# EAGLE design board (EAGLE 7.4.0)
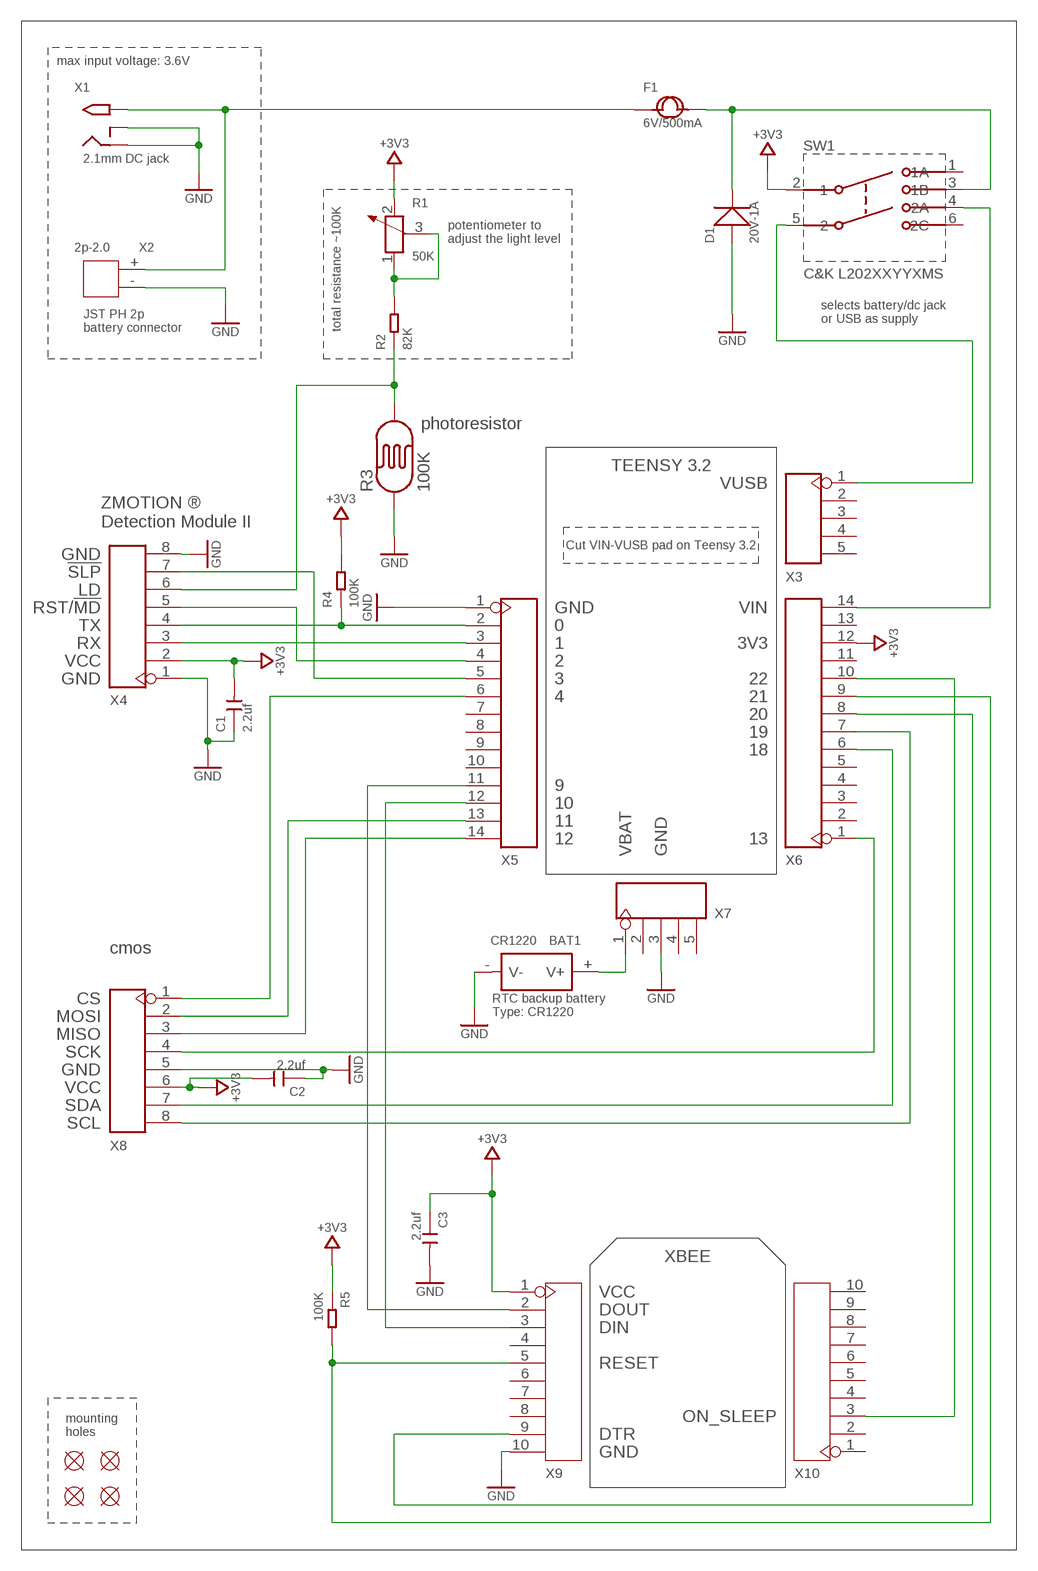
[diagram p0: schematic, sheet 1]

## Parts
BAT1  CR1220  SMD-BATTERY-CELL-HOLDER-PLASTIC  [BAT2P-SMD-16.4-CR1220]
C1  2.2uf  CERAMIC-2.2UF-25V-10%-X7R(0805)  [C0805]
C2  2.2uf  CERAMIC-2.2UF-25V-10%-X7R(0805)  [C0805]
C3  2.2uf  CERAMIC-2.2UF-25V-10%-X7R(0805)  [C0805]
D1  20V-1A  SMD-DIODE-SCHOTTKY-20V-1A(SOD-123)  [SOD-123]
F1  6V/500mA  SMD-PPTC-500MA(1206)  [F1206]
MNT1  MOUNTING_HOLE3.2MM_SILK  [HOLE_3.2MM_SILK]
MNT2  MOUNTING_HOLE3.2MM_SILK  [HOLE_3.2MM_SILK]
MNT3  MOUNTING_HOLE3.2MM_SILK  [HOLE_3.2MM_SILK]
MNT4  MOUNTING_HOLE3.2MM_SILK  [HOLE_3.2MM_SILK]
R1  50K  RES-ADJ-SX3362P  [ADJR3-7.0X7.0X5.0MM]
R2  82K  SMD-RES-56K-5%-1/(0805)  [R0805]
R3  100K  CDS_PHOTOCELL_PHOTORESISTOR4.2X3.4MM_PITCH_2.54MM  [CDS_4.2X3.4MM_PITCH:2.54MM]
R4  100K  SMD-RES-100K-1%-1/8W(0805)  [R0805]
R5  100K  SMD-RES-100K-1%-1/8W(0805)  [R0805]
SW1  C&K L202XXYYXMS  DPDTL202XXYYXMS  [C&K_L102_MS]
X1  2.1MMJACKTHM  [PJ-102A]
X2  2p-2.0  DIP-JST-2P-2.0  [H2-2.0-6X4.5MM]
X3  5p-2.54  DIP-BLACK-FEMALE-HEADER-VERT(5P-2.54)  [H5-2.54]
X4  8p-2.54  DIP-BLACK-FEMALE-HEADER-VERT(8P-2.54)  [H8-2.54]
X5  14p-2.54  DIP-YELLOW-MALE-HEADER-VERT(14P-2.54)  [H14-2.54]
X6  14p-2.54  DIP-YELLOW-MALE-HEADER-VERT(14P-2.54)  [H14-2.54]
X7  5p-2.54  DIP-BLACK-FEMALE-HEADER-VERT(5P-2.54)  [H5-2.54]
X8  8p-2.54  DIP-BLACK-FEMALE-HEADER-VERT(8P-2.54)  [H8-2.54]
X9  10p-2.0  DIP-BLACK-FEMALE-HEADER-VERT(10P-2.0)  [H10-2.0]
X10  10p-2.0  DIP-BLACK-FEMALE-HEADER-VERT(10P-2.0)  [H10-2.0]

## Nets
+3V3: C1.2 C2.2 C3.1 R1.2 R4.2 R5.1 SW1.2 X4.2 X6.12 X8.6 X9.1
D3: X4.7 X5.5
GND: BAT1.-(V-) C1.1 C2.1 C3.2 D1.+ R3.P$1 X1.RING X1.RING_SW X2.- X4.1 X4.8 X5.1 X7.3 X8.5 X9.10
N$1: X5.11 X9.2
N$2: X5.12 X9.3
N$3: BAT1.+(V+) X7.1
N$4: X4.3 X5.3
N$5: R4.1 X4.4 X5.2
N$6: X4.5 X5.4
N$7: R1.1 R1.3 R2.2
N$8: X6.7 X8.8
N$9: X6.6 X8.7
N$10: X6.1 X8.4
N$11: X5.14 X8.3
N$12: X5.13 X8.2
N$13: X5.6 X8.1
N$14: R2.1 R3.P$2 X4.6
N$15: X6.8 X9.9
N$16: R5.2 X6.9 X9.5
N$17: X6.10 X10.3
N$18: SW1.4(2A) X6.14
N$19: SW1.5 X3.1
N$20: D1.- F1.2 SW1.3(1B)
N$23: F1.1 X1.TIP X2.+
Unconnected: SW1.1(1A) SW1.6(2C) X3.2 X3.3 X3.4 X3.5 X5.7 X5.8 X5.9 X5.10 X6.2 X6.3 X6.4 X6.5 X6.11 X6.13 X7.2 X7.4 X7.5 X9.4 X9.6 X9.7 X9.8 X10.1 X10.2 X10.4 X10.5 X10.6 X10.7 X10.8 X10.9 X10.10

## Notes on the sheet
- max input voltage: 3.6V
- 2.1mm DC jack
- potentiometer to 
  adjust the light level
- selects battery/dc jack 
  or USB as supply
- JST PH 2p 
  battery connector
- total resistance ~100K
- photoresistor
- TEENSY 3.2
- VUSB
- ZMOTION ®  
  Detection Module II
- Cut VIN-VUSB pad on Teensy 3.2
- GND
- !SLP
- LD
- RST/!MD | GND | VIN
- TX | 0
- RX | 1 | 3V3
- VCC | 2
- GND | 3 | 22
- 4 | 21
- 20
- 19
- 18
- 9
- 10
- 11
- 12 | 13
- VBAT | GND
- cmos
- CS
- MOSI
- RTC backup battery
  Type: CR1220
- MISO
- SCK
- GND
- VCC
- SDA
- SCL
- XBEE
- VCC
- DOUT
- DIN
- RESET
- ON_SLEEP
- mounting 
  holes
- DTR
- GND

## Library data of the parts
BAT1 = Seeed-OPL-Connector:SMD-BATTERY-CELL-HOLDER-PLASTIC: 320170000
C1-C3 = Seeed-OPL-Capacitor:CERAMIC-2.2UF-25V-10%-X7R(0805): 302010148; MPN: CC0805KKX7R8BB225
D1 = Seeed-OPL-Diode:SMD-DIODE-SCHOTTKY-20V-1A(SOD-123): 304020034; MPN: B5819W
F1 = Seeed-OPL-fuse:SMD-PPTC-500MA(1206): 307010002; MPN: SMD1206R500SF; VALUE: SMD1206R500SF
MNT1-MNT4 = teensybee:MOUNTING_HOLE
R1 = Seeed-OPL-Resistor:RES-ADJ: Potentiometer
R2 = Seeed-OPL-Resistor:SMD-RES-56K-5%-1/(0805): 301010327; MPN: RC0805JR-0756KL; VALUE: 56K
R3 = teensybee:CDS_PHOTOCELL_PHOTORESISTOR
R4 R5 = Seeed-OPL-Resistor:SMD-RES-100K-1%-1/8W(0805): 301010396; MPN: RC0805FR-07100KL
SW1 = teensybee:DPDT
X1 = adafruit:2.1MMJACK: 2.1mm x 5.5mm THM DC jack with internal switch. Digikey part #PJ-102A, 4UCON part #05537 2.1mm x 5.5mm SMT DC jack with internal switch. Digikey part #PJ-002A-SMT, 4UCON part #03267 By microbuilder.eu & adafruit.com
X2 = Seeed-OPL-Connector:DIP-JST-2P-2.0: 320110049
X3 X7 = teensybee:DIP-BLACK-FEMALE-HEADER-VERT(5P-2.54): 320030028; MPN: F185-1105A0BSYA1
X4 X8 = Seeed-OPL-Connector:DIP-BLACK-FEMALE-HEADER-VERT(8P-2.54): 320030061; MPN: F185-1108A1BSYC1
X5 X6 = teensybee:DIP-YELLOW-MALE-HEADER-VERT(14P-2.54): 320020123; MPN: P125-1114A0BS116AX
X9 X10 = Seeed-OPL-Connector:DIP-BLACK-FEMALE-HEADER-VERT(10P-2.0): 320030009; MPN: F243-1110A1BSUA1

## Board
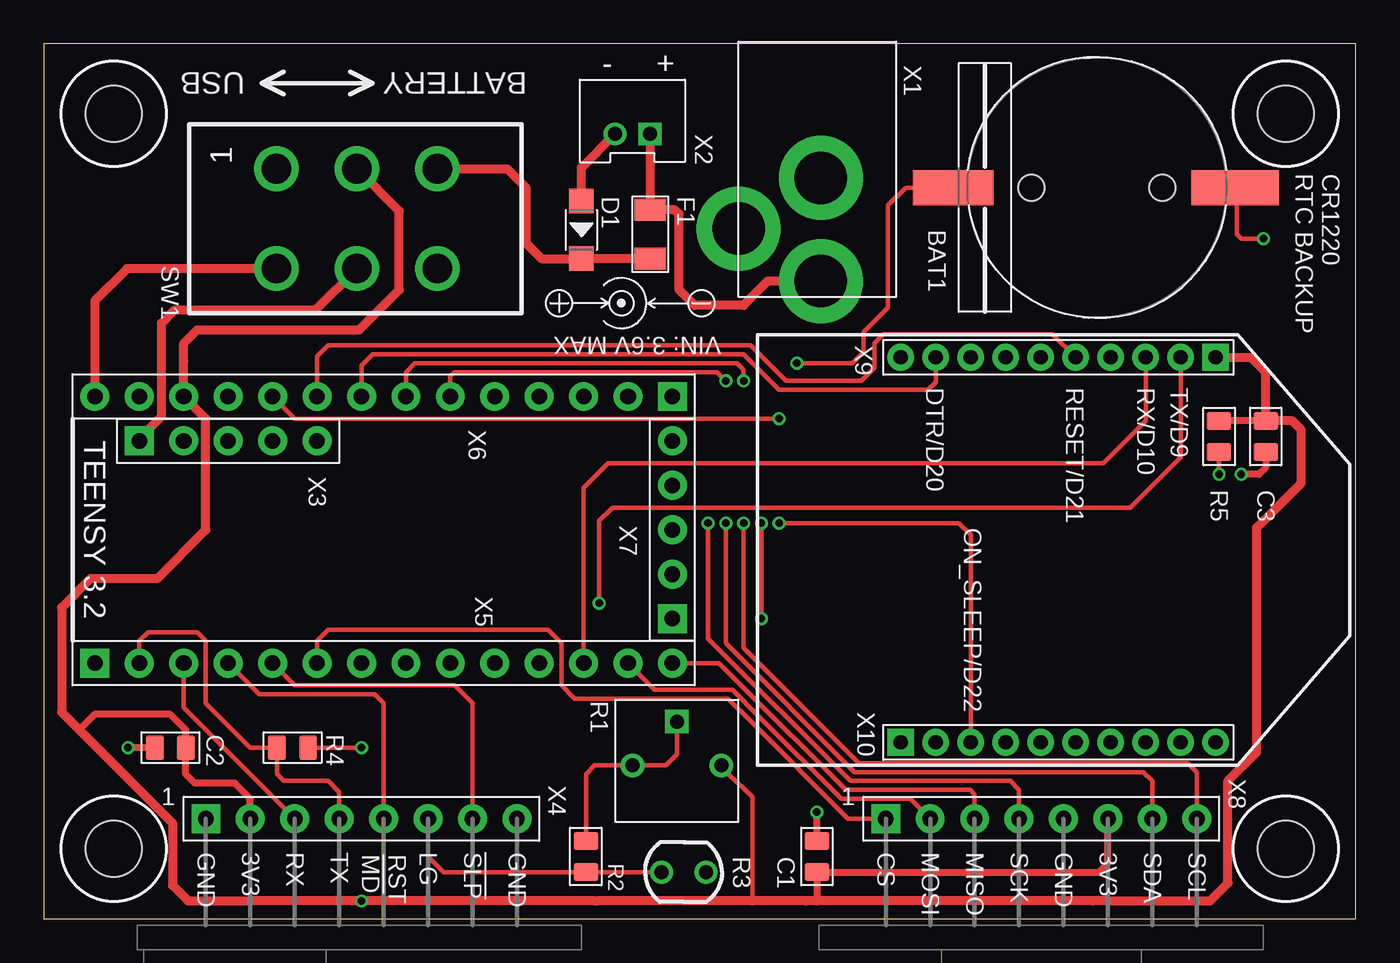
[diagram p1: board, top side]
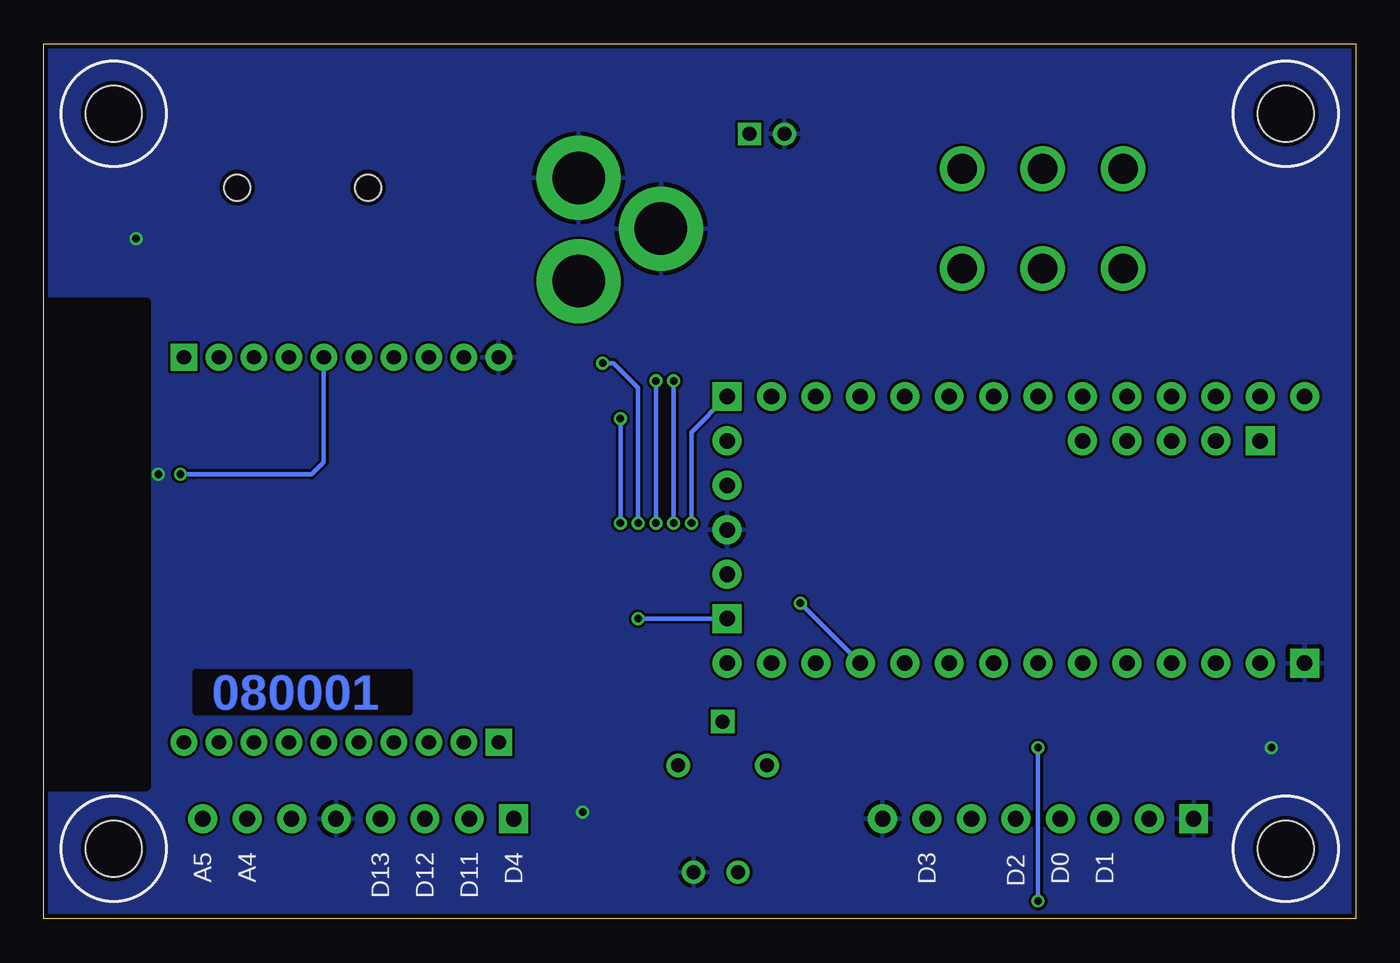
[diagram p2: board, bottom side, seen from below]

Size 75 x 50 mm. Coordinates in mm from the lower left corner, seen from the top.
Outline: 0,0 75,0 75,50 0,50 0,0
Copper layers (1*16): Top 0.035mm / dielectric 1.5mm / Bottom 0.035mm
Design rules "Elecrow_2-layer_eagle_rule": minimum track width 6mil, minimum drill 0.3mm, track to track 6mil, track to pad 6mil, pad to pad 6mil, via to via 6mil, smd to smd 0mil, copper to edge 10mil, drill to drill 10mil, minimum pad ring 10mil, minimum via ring 6mil, stop-mask expansion 2mil, vias tented up to drill 25mil, thermal gap 10mil
bRestrict: 7 lines

### Footprints (pad centres in the part's own frame; a part is rotated, then mirrored left to right if it is on the bottom)
BAT2P-SMD-16.4-CR1220 = smd 2 x 4.6: + 0,-8.2 | smd 2 x 5: - 0,7.9 | hole 1.5: 0,3.75; 0,-3.75
C0805 = smd 1.397 x 1.016: 1 0,0.889; 2 0,-0.889
SOD-123 = smd 1.397 x 1.397: + -1.651,0; - 1.651,0
F1206 = smd 1.27 x 1.778: 1 -1.397,0; 2 1.397,0
HOLE_3.2MM_SILK = hole 3.2: 0,0
ADJR3-7.0X7.0X5.0MM = drill 0.8 pad 1.35: 1 -2.54,-0.25; 2 2.54,-0.25 | drill 0.8 pad 1.35 square: 3 0,2.25
R0805 = smd 1.397 x 1.016: 1 0,0.889; 2 0,-0.889
CDS_4.2X3.4MM_PITCH:2.54MM = drill 0.8: P$1 -1.27,0; P$2 1.27,0
C&K_L102_MS = drill 1.7: 1 -2.85,-4.6; 2 -2.85,0; 3 -2.85,4.6; 4 2.85,-4.6; 5 2.85,0; 6 2.85,4.6
PJ-102A = drill 3 pad 4.8: RING 0.1,-3.39; RING_SW -4.6,-6.29; TIP 0.1,-9.29
H2-2.0-6X4.5MM = drill 0.8 pad 1.3 square: + -1,0.75 | drill 0.8 pad 1.3: - 1,0.75
H5-2.54 = drill 0.889 pad 1.651 square: 1 0,5.08 | drill 0.889 pad 1.651: 2 0,2.54; 3 0,0; 4 0,-2.54; 5 0,-5.08
H8-2.54 = drill 0.889 pad 1.651 square: 1 0,8.89 | drill 0.889 pad 1.651: 2 0,6.35; 3 0,3.81; 4 0,1.27; 5 0,-1.27; 6 0,-3.81; 7 0,-6.35; 8 0,-8.89
H14-2.54 = drill 0.889 pad 1.651 square: 1 0,16.51 | drill 0.889 pad 1.651: 2 0,13.97; 3 0,11.43; 4 0,8.89; 5 0,6.35; 6 0,3.81; 7 0,1.27; 8 0,-1.27; 9 0,-3.81; 10 0,-6.35; 11 0,-8.89; 12 0,-11.43; 13 0,-13.97; 14 0,-16.51
H10-2.0 = drill 0.813 pad 1.524 square: 1 0,9 | drill 0.813 pad 1.524: 2 0,7; 3 0,5; 4 0,3; 5 0,1; 6 0,-1; 7 0,-3; 8 0,-5; 9 0,-7; 10 0,-9

### Placement (x,y rotation side)
BAT1  60.2,41.78 270 top
C1  44.2,3.56 0 top
C2  7.24,9.78 90 top
C3  69.85,27.56 0 top
D1  30.73,39.37 270 top
F1  34.67,39.12 270 top
MNT1  4,4 0 top
MNT2  71,4 0 top
MNT3  4,46 0 top
MNT4  71,46 0 top
R1  36.2,9.02 0 top
R2  30.99,3.56 180 top
R3  36.58,2.67 180 top
R4  14.22,9.78 90 top
R5  67.18,27.56 0 top
SW1  17.91,40.01 270 top
U$1  [DCBARREL_DESC]  33.02,35.18 0 top
X1  44.32,45.72 0 top
X2  33.66,45.59 180 top
X3  10.54,27.3 90 top
X4  18.16,5.71 90 top
X5  19.43,14.61 90 top
X6  19.43,29.84 270 top
X7  35.94,22.23 180 top
X8  57.02,5.71 90 top
X9  57.99,32.08 270 top
X10  57.99,10.08 90 top

### Tracks (layer width: path | path; a pad name or v marks a point on that pad's centre or on a via)
+3V3  (via drill 0.43)
  Top 0.254: R4.2 v18.16,9.78 | R1.2 38.73,8.64 40.51,6.99 40.51,1.02
  Top 0.406: 31.62,1.02 31.5,1.02 | X4.2 11.81,6.86 10.92,7.75 8.64,7.75 8.13,8.26 C2.2 8.13,10.79 7.24,11.68 2.92,11.68 2.03,10.79 | 44.2,1.02 C1.2 60.33,2.67 60.83,3.17 X8.6 | C3.1 R5.1
  Top 0.508: 31.62,1.02 40.51,1.02 43.56,1.02 44.2,1.02 59.94,1.02 60.83,1.02 66.67,1.02 67.69,2.03 67.69,7.87 69.34,9.53 69.34,22.35 71.88,24.89 71.88,27.94 71.37,28.45 C3.1 69.85,31.24 69.01,32.08 X9.1 | 31.5,1.02 v18.16,1.02 17.65,1.02 11.81,1.02 8.26,1.02 7.37,1.91 7.37,5.46 2.03,10.79 1.02,11.81 1.02,17.78 2.67,19.43 6.48,19.43 9.27,22.23 9.27,28.57 X6.12 8,31.88 8,32.89 8.76,33.66 18.03,33.66 20.32,35.94 20.32,40.44 SW1.2
  Bottom 0.254: v18.16,9.78 v18.16,1.02
D3
  Top 0.254: X4.7 24.51,12.32 23.5,13.34 14.35,13.34 X5.5
GND  (via drill 0.43)
  Top 0.254: v69.72,38.86 68.45,38.86 68.2,39.12 68.2,41.68 BAT1.-
  Top 0.406: C2.1 v4.83,9.78 | C1.1 v44.2,6.1 | C3.2 69.85,25.78 69.47,25.4 v68.45,25.4
  Top 0.508: D1.+ 30.73,42.92 X2.-
  pour Bottom: -12.05,64.83 -10.92,-0.13 112.52,-0.38 111.65,61.78
N$1  (via drill 0.43)
  Top 0.254: v31.75,18.03 31.75,22.73 32.51,23.5 62.1,23.5 64.99,26.38 X9.2
  Bottom 0.254: X5.11 v31.75,18.03
N$2
  Top 0.254: X5.12 30.86,24.64 32.26,26.04 60.58,26.04 62.99,28.45 X9.3
N$3  (via drill 0.43)
  Top 0.254: v41.02,17.14 v41.02,22.61 | v43.05,31.75 46.23,31.75 46.86,32.38 46.86,33.53 48.26,34.92 48.26,40.77 49.28,41.78 BAT1.+
  Bottom 0.254: X7.1 v41.02,17.14 | v41.02,22.61 41.02,30.35 42.42,31.75 v43.05,31.75
N$4
  Top 0.254: X5.3 8,12.06 X4.3
N$5
  Top 0.254: X5.2 5.46,15.88 5.97,16.38 8.76,16.38 9.27,15.88 9.27,12.32 11.81,9.78 R4.1 13.34,8.26 13.72,7.87 16.26,7.87 16.89,7.24 X4.4
N$6
  Top 0.254: X4.5 19.43,12.32 18.92,12.83 12.32,12.83 X5.4
N$7
  Top 0.254: R2.2 30.99,8.26 31.5,8.76 R1.1 35.56,8.77 36.2,9.4 R1.3
N$8  (via drill 0.43)
  Top 0.254: X6.7 20.7,31.24 21.21,31.75 39.62,31.75 40.01,31.37 v40.01,30.73 | X8.8 65.91,8.38 65.41,8.89 46.61,8.89 40.01,15.49 v40.01,22.61
  Bottom 0.254: v40.01,30.73 v40.01,22.61
N$9  (via drill 0.43)
  Top 0.254: X6.6 23.24,30.99 23.5,31.24 38.48,31.24 v38.99,30.73 | X8.7 63.37,7.87 62.87,8.38 46.35,8.38 38.99,15.75 v38.99,22.61
  Bottom 0.254: v38.99,30.73 v38.99,22.61
N$10  (via drill 0.43)
  Top 0.254: X8.4 55.75,7.37 55.24,7.87 46.1,7.87 37.97,16 v37.97,22.61
  Bottom 0.254: X6.1 37.97,27.81 v37.97,22.61
N$11
  Top 0.254: X8.3 53.21,7.11 52.96,7.37 45.85,7.37 39.75,13.46 38.61,14.61 X5.14
N$12
  Top 0.254: X8.2 49.53,6.86 45.59,6.86 40.89,11.56 | 40.89,11.56 40.51,11.94 | X5.13 34.92,13.08 39.37,13.08 40.89,11.56
N$13
  Top 0.254: X8.1 45.97,5.71 40.39,11.3 39.12,12.57 30.35,12.57 29.59,13.34 29.59,14.1 29.59,15.75 28.83,16.51 26.42,16.51 16.26,16.51 15.62,15.88 X5.6
N$14
  Top 0.254: R3.P$2 R2.1 22.86,2.67 21.97,3.56 X4.6
N$15
  Top 0.254: X6.8 18.16,31.62 18.8,32.26 40.01,32.26 42.04,30.23 50.55,30.23 50.99,30.67 X9.9
N$16  (via drill 0.43)
  Top 0.254: X6.9 15.62,32.13 16.26,32.77 24,32.77 24.13,32.77 40.39,32.77 42.42,30.73 46.74,30.73 47.5,31.5 47.5,32.89 48.01,33.4 57.67,33.4 X9.5 | v67.18,25.4 R5.2
  Bottom 0.254: X9.5 58.99,26.1 59.69,25.4 66.42,25.4 v67.18,25.4
N$17  (via drill 0.43)
  Top 0.254: v42.04,28.57 14.35,28.57 X6.10 | v42.04,22.61 52.32,22.61 52.99,21.94 X10.3
  Bottom 0.254: v42.04,28.57 v42.04,22.61
N$18
  Top 0.508: SW1.4 4.77,37.16 2.92,35.31 X6.14
N$19
  Top 0.508: X3.1 5.46,27.43 6.73,28.7 6.73,34.04 7.49,34.8 15.55,34.8 SW1.5
N$20
  Top 0.508: F1.2 D1.- 28.45,37.72 27.56,38.61 27.56,41.78 26.49,42.85 SW1.3
N$23
  Top 0.508: X2.+ 34.66,40.66 F1.1 36.07,40.51 36.32,40.26 36.32,35.94 37.21,35.05 40.01,35.05 41.38,36.43 X1.TIP

### Text on the board
Bottom: 080001
tPlace: - | + | USB | BATTERY | CR1220 / RTC BACKUP | VIN: 3.6V MAX | DTR/D20 | RESET/D21 | RX/D10 | TX/D9 | TEENSY 3.2 | ON_SLEEP/D22 | 1 | 1 | GND | 3V3 | RX | TX | RST / !MD | LG | !SLP | GND | CS | MOSI | MISO | SCK | GND | 3V3 | SDA | SCL
bPlace: D1 | D0 | D2 | D3 | D4 | D11 | D12 | D13 | A4 | A5